# Altium schematic sheet Sensors.SchDoc
size A4; SheetNumber: 2; SheetTotal: 2
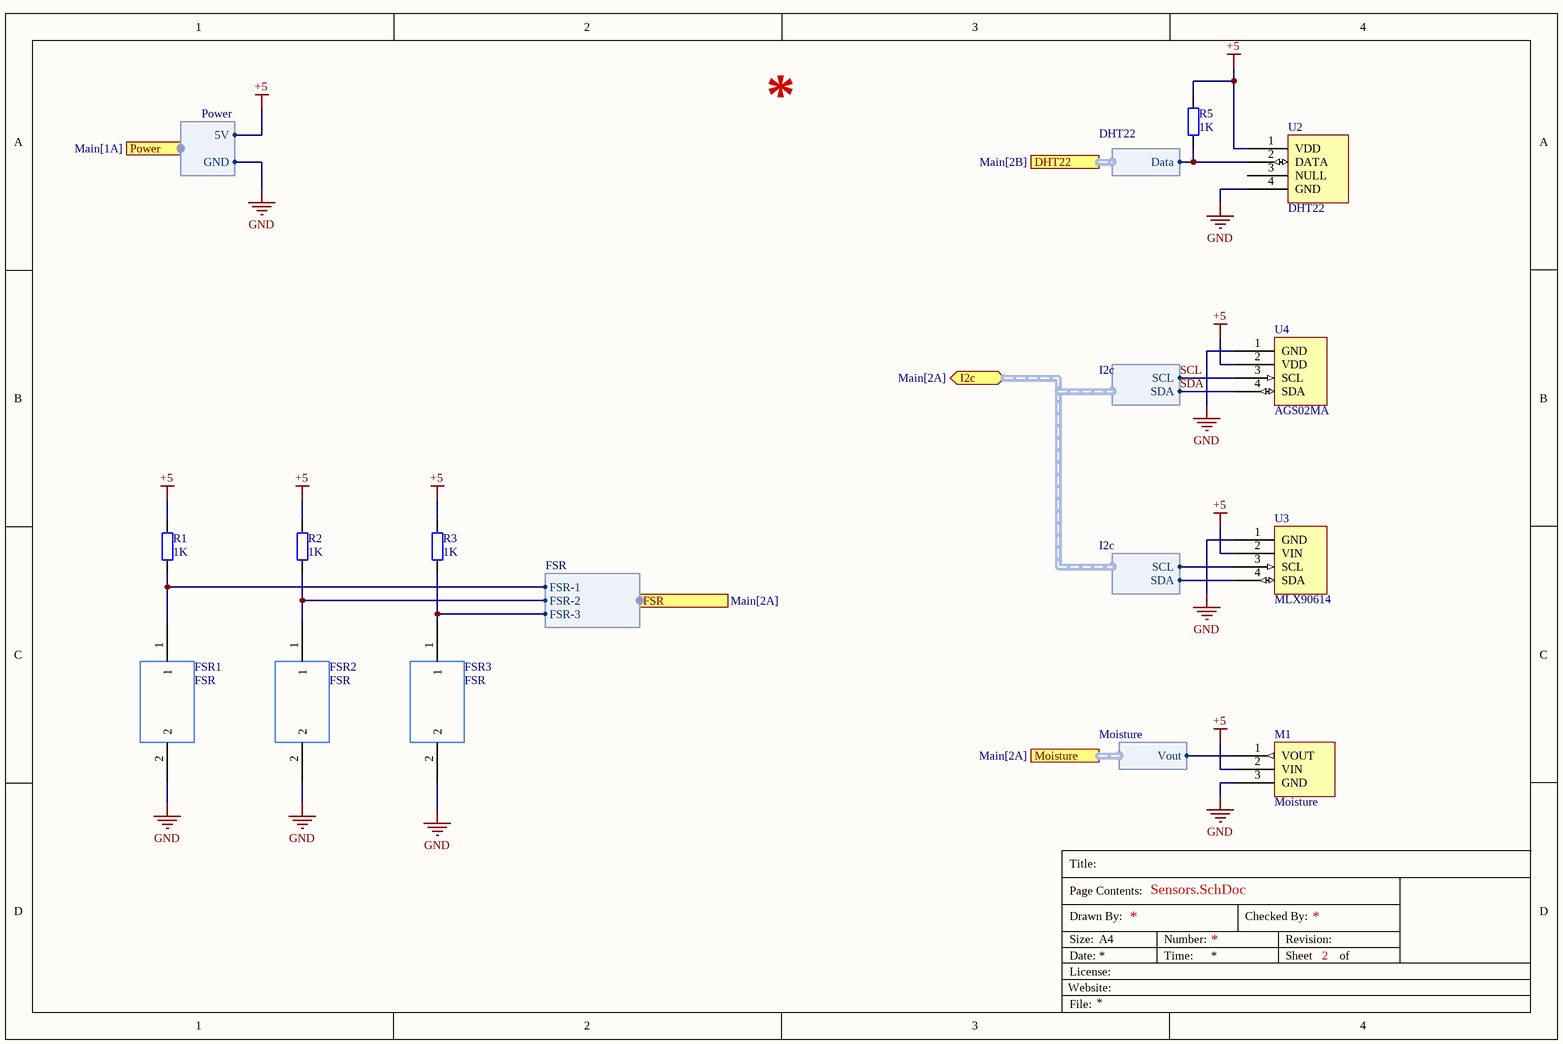
[diagram p0: Sensors.SchDoc]

## Parts
FSR1  FSR  [JST-XH 2pin]
FSR2  FSR  [JST-XH 2pin]
FSR3  FSR  [JST-XH 2pin]
M1  Moisture  [JST-XH 3PIN]
R1  1K  [R1206]
R2  1K  [R1206]
R3  1K  [R1206]
R5  1K  [R1206]
U2  DHT22  [JST-XH 4PIN]
U3  MLX90614  [JST-XH 4PIN]
U4  AGS02MA  [JST-XH 4PIN]

## Ports
DHT22 (harness DHT22, see Main[2B]), FSR (harness FSR, see Main[2A]), I2c (bidir, harness I2c, see Main[2A]), Moisture (harness Moisture, see Main[2A]), Power (harness Power, see Main[1A])

## Harnesses
FSR: FSR-1, FSR-2, FSR-3
Power: 5V, GND
I2c: SDA, SCL
Moisture: Vout
DHT22: Data

## Nets
+5: M1.2(VIN) R1.2 R2.2 R3.2 R5.2 U2.1(VDD) U3.2(VIN) U4.2(VDD) ; port Power.5V
GND: FSR1.2 FSR2.2 FSR3.2 M1.3(GND) U2.4(GND) U3.1(GND) U4.1(GND) ; port Power.GND
SCL: U3.3(SCL) U4.3(SCL) ; port I2c.SCL
SDA: U3.4(SDA) U4.4(SDA) ; port I2c.SDA
NetFSR1_1: FSR1.1 R1.1 ; port FSR.FSR-1
NetFSR2_1: FSR2.1 R2.1 ; port FSR.FSR-2
NetFSR3_1: FSR3.1 R3.1 ; port FSR.FSR-3
NetM1_1: M1.1(VOUT) ; port Moisture.Vout
NetR5_1: R5.1 U2.2(DATA) ; port DHT22.Data

Not connected (* = marked no-connect by the designer): U2 3(NULL)

## Notes on the sheet
- Title:
- Drawn By:
- Page Contents:
- Checked By:
- Website:
- Size:
- Date:
- File:
- License:
- A4
- Number:
- Time:
- Revision:
- Sheet
- of

## Library data of the parts
FSR1-FSR3 = FSR: 2 pin JST connector
R1-R3 R5 = Resistor_1206: SMD Resistor 1206; Published: 03-11-2016; LatestRevisionDate: 03-11-2016; LatestRevisionNote: Creation; PackageReference: R1206; Publisher: Windesheim; PackageDescription: Chip Resistor, Body 3.2x1.6mm, IPC Medium Density; Value: 1K
U2 = DHT22: https://www.tinytronics.nl/en/sensors/air/humidity/dht22-thermometer-temperature-and-humidity-sensor
U3 = MLX90614: https://www.tinytronics.nl/en/sensors/temperature/non-contact-ir-temperature-sensor-module-mlx90614-baa-90